# Altium schematic sheet eBox_Wifi.SchDoc: eBox_3G
size A4; DocumentNumber: 9; SheetNumber: 9; SheetTotal: 9
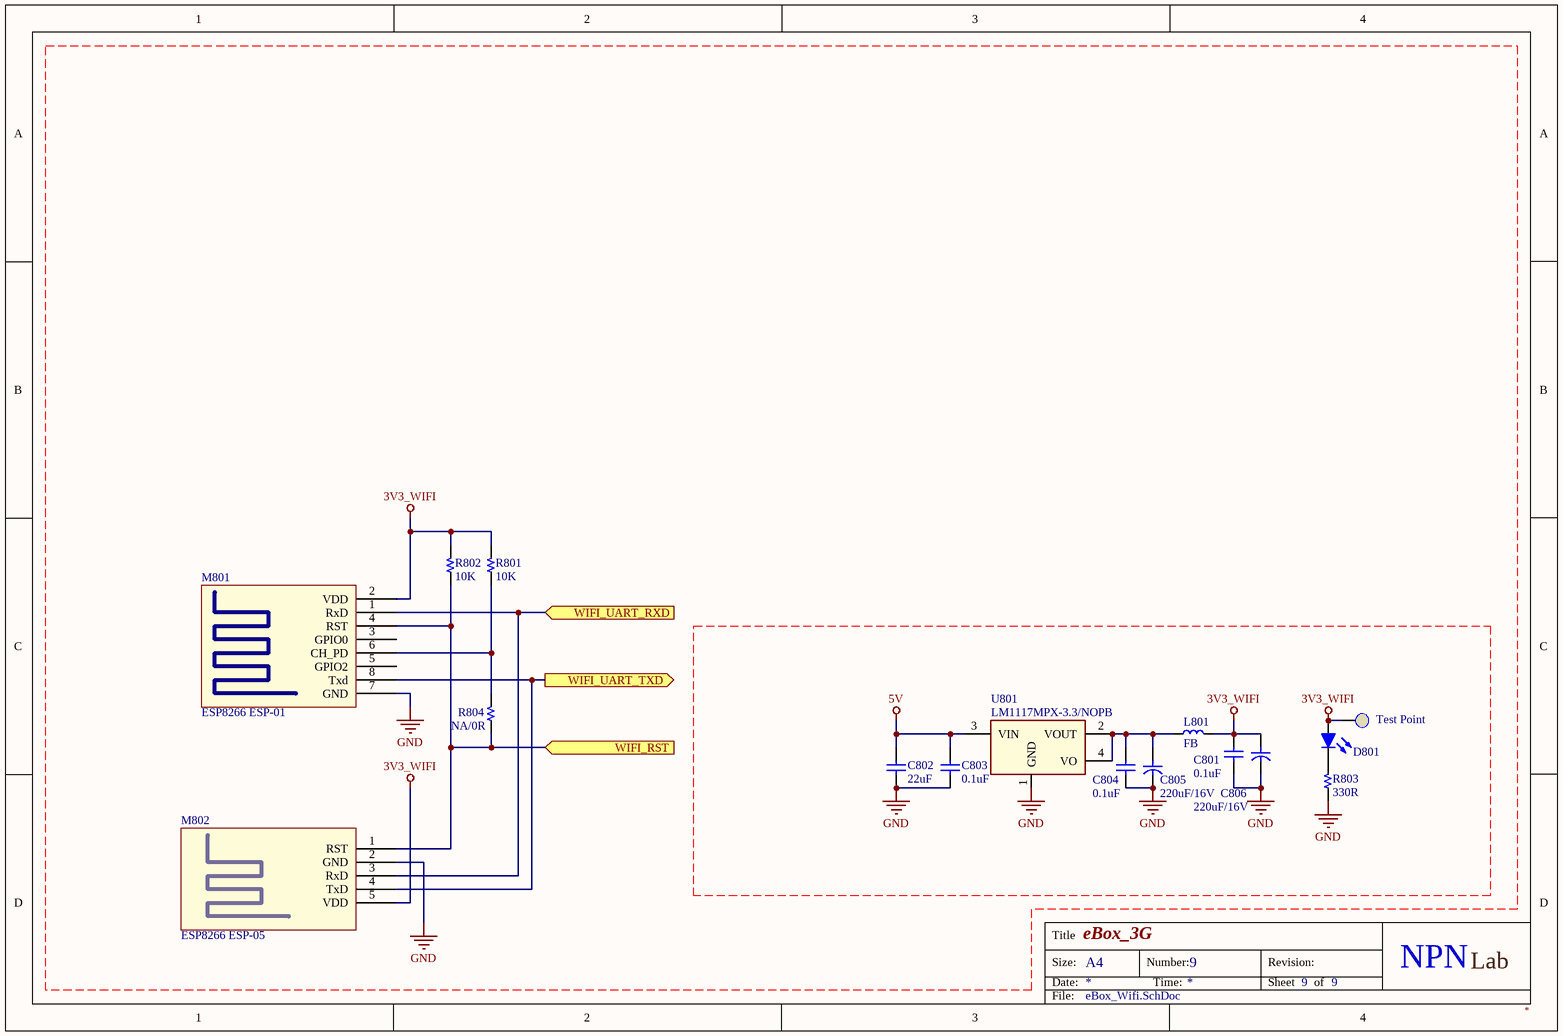
[diagram p0: eBox_Wifi.SchDoc]

## Parts
3V3WiFi  Test Point  [TestPoint/SMD/1.5mm]  (no BOM)
C801  0.1uF  [C 0805]
C802  22uF  [C 1210 mix 0805]
C803  0.1uF  [C 0805]
C804  0.1uF  [C 0805]
C805  220uF/16V  [CYL/D.250/LS.100-D63H70P25]
C806  220uF/16V  [CYL/D.250/LS.100-D63H70P25]
D801  LED RED 3MM  [LED 3MM - red]  (value not drawn)
L801  FB  [L 0805 (2012)]
M801  ESP8266 ESP-01  [ESP8266 ESP-01]
M802  ESP8266 ESP-05  [ESP8266 ESP-05]
R801  10K  [R 0603]
R802  10K  [R 0603]
R803  330R  [R 0603]
R804  NA/0R  [R 0603]
U801  LM1117MPX-3.3/NOPB  [SOT-223]

## Ports
WIFI_RST (in), WIFI_UART_RXD (in), WIFI_UART_TXD (out)

## Nets
3V3_WIFI: 3V3WiFi.1(TP) C801.1 C806.1 D801.1(A) L801.2 M801.2(VDD) M802.5(VDD) R801.2 R802.2
5V: C802.1 C803.1 U801.3(VIN)
GND: C801.2 C802.2 C803.2 C804.2 C805.2 C806.2 M801.7(GND) M802.2(GND) R803.1 U801.1(GND)
WIFI_RST: M801.4(RST) M802.1(RST) R802.1 R804.1 ; port WIFI_RST
WIFI_UART_RXD: M801.1(RxD) M802.3(RxD) ; port WIFI_UART_RXD
WIFI_UART_TXD: M801.8(Txd) M802.4(TxD) ; port WIFI_UART_TXD
NetC804_1: C804.1 C805.1 L801.1 U801.2(VOUT) U801.4(VO)
NetD801_2: D801.2(K) R803.2
NetM801_6: M801.6(CH_PD) R801.1 R804.2

Not connected (* = marked no-connect by the designer): M801 3(GPIO0) 5(GPIO2)

## Notes on the sheet
- Title
- Size:
- Date:
- A4
- Number:
- Time:
- Revision:
- Sheet
- of
- NPN
- Lab
- File:

## Library data of the parts
C801 C803 C804 = Capacitor NP: CAP CER 0.1UF 50V X7R 0805; TYPE: SMD; PACKAGE: SMD0805; STOCK CODE: CL21B104KBNC; SUPPLIER: tme.vn; STOCK DESC: 100nF/50V ±10% X7R SMD-0805 Capacitor; UNIT PRICE: 400
C802 = Capacitor NP: CAP CER 22UF 10% 16V X7R 1210; TYPE: SMD; PACKAGE: SMD1210; STOCK CODE: CC1210KKX7R7BB226; SUPPLIER: tme.vn; STOCK DESC: 22uF/16V ±10% X7R SMD-1210 Capacitor; UNIT PRICE: 2500
C805 C806 = Capacitor: CAP ALUM 220UF 20% 16V RADIAL; TYPE: TH; PACKAGE: 6.3x12; STOCK CODE: 220uF/16V; SUPPLIER: tme.vn; STOCK DESC: 220uF/16V ±20% Aluminum Electrolytic Capacitor, Size 6.3x12mm; UNIT PRICE: 900
D801 = Led: LED RED DIFFUSED 3MM ROUND T/H; TYPE: TH; PACKAGE: 3MM; STOCK CODE: HT204SURD; SUPPLIER: tme.vn; STOCK DESC: 3mm Base LED; UNIT PRICE: 300
L801 = Inductor: Chip Ferrite Bead; TYPE: SMD; PACKAGE: SMD0805; STOCK CODE: CB2012D300ST(F); SUPPLIER: tme.vn; STOCK DESC: 30 Ohm SMD-0805 Chip Ferrite Bead; UNIT PRICE: 500
R801 R802 = Resistor: RES SMD 10K OHM 1% 1/10W 0603; PACKAGE: SMD0603; STOCK CODE: 0603F1000T5E; SUPPLIER: tme.vn; TYPE: SMD; STOCK DESC: 10K ±1% SMD-0603 Resistor; UNIT PRICE: 60
R803 = Resistor: RES SMD 330 OHM 1% 1/10W 0603; PACKAGE: SMD0603; STOCK CODE: RM06JTN331; SUPPLIER: tme.vn; TYPE: SMD; STOCK DESC: 330R ±5% SMD-0603 Resistor; UNIT PRICE: 50
R804 = Resistor: RES SMD 0 OHM 1% 1/10W 0603; PACKAGE: SMD0603; TYPE: SMD
U801 = AMS1117: IC REG LINEAR 3.3V 800MA SOT223; BRAND: AMS; PACKAGE: SOT-223; STOCK CODE: AMS1117-3.3; SUPPLIER: tme.vn; TYPE: SMD; STOCK DESC: 3.3V 1A Low-dropout Linear Regulator; UNIT PRICE: 4000
3V3WiFi = Test Point: TYPE: NO-BOM; UNIT PRICE: 0
M801 = ESP8266 ESP-01: TYPE: NA
M802 = ESP8266 ESP-05: TYPE: NA